# EAGLE schematic D1MSHO (EAGLE 9.0.1)
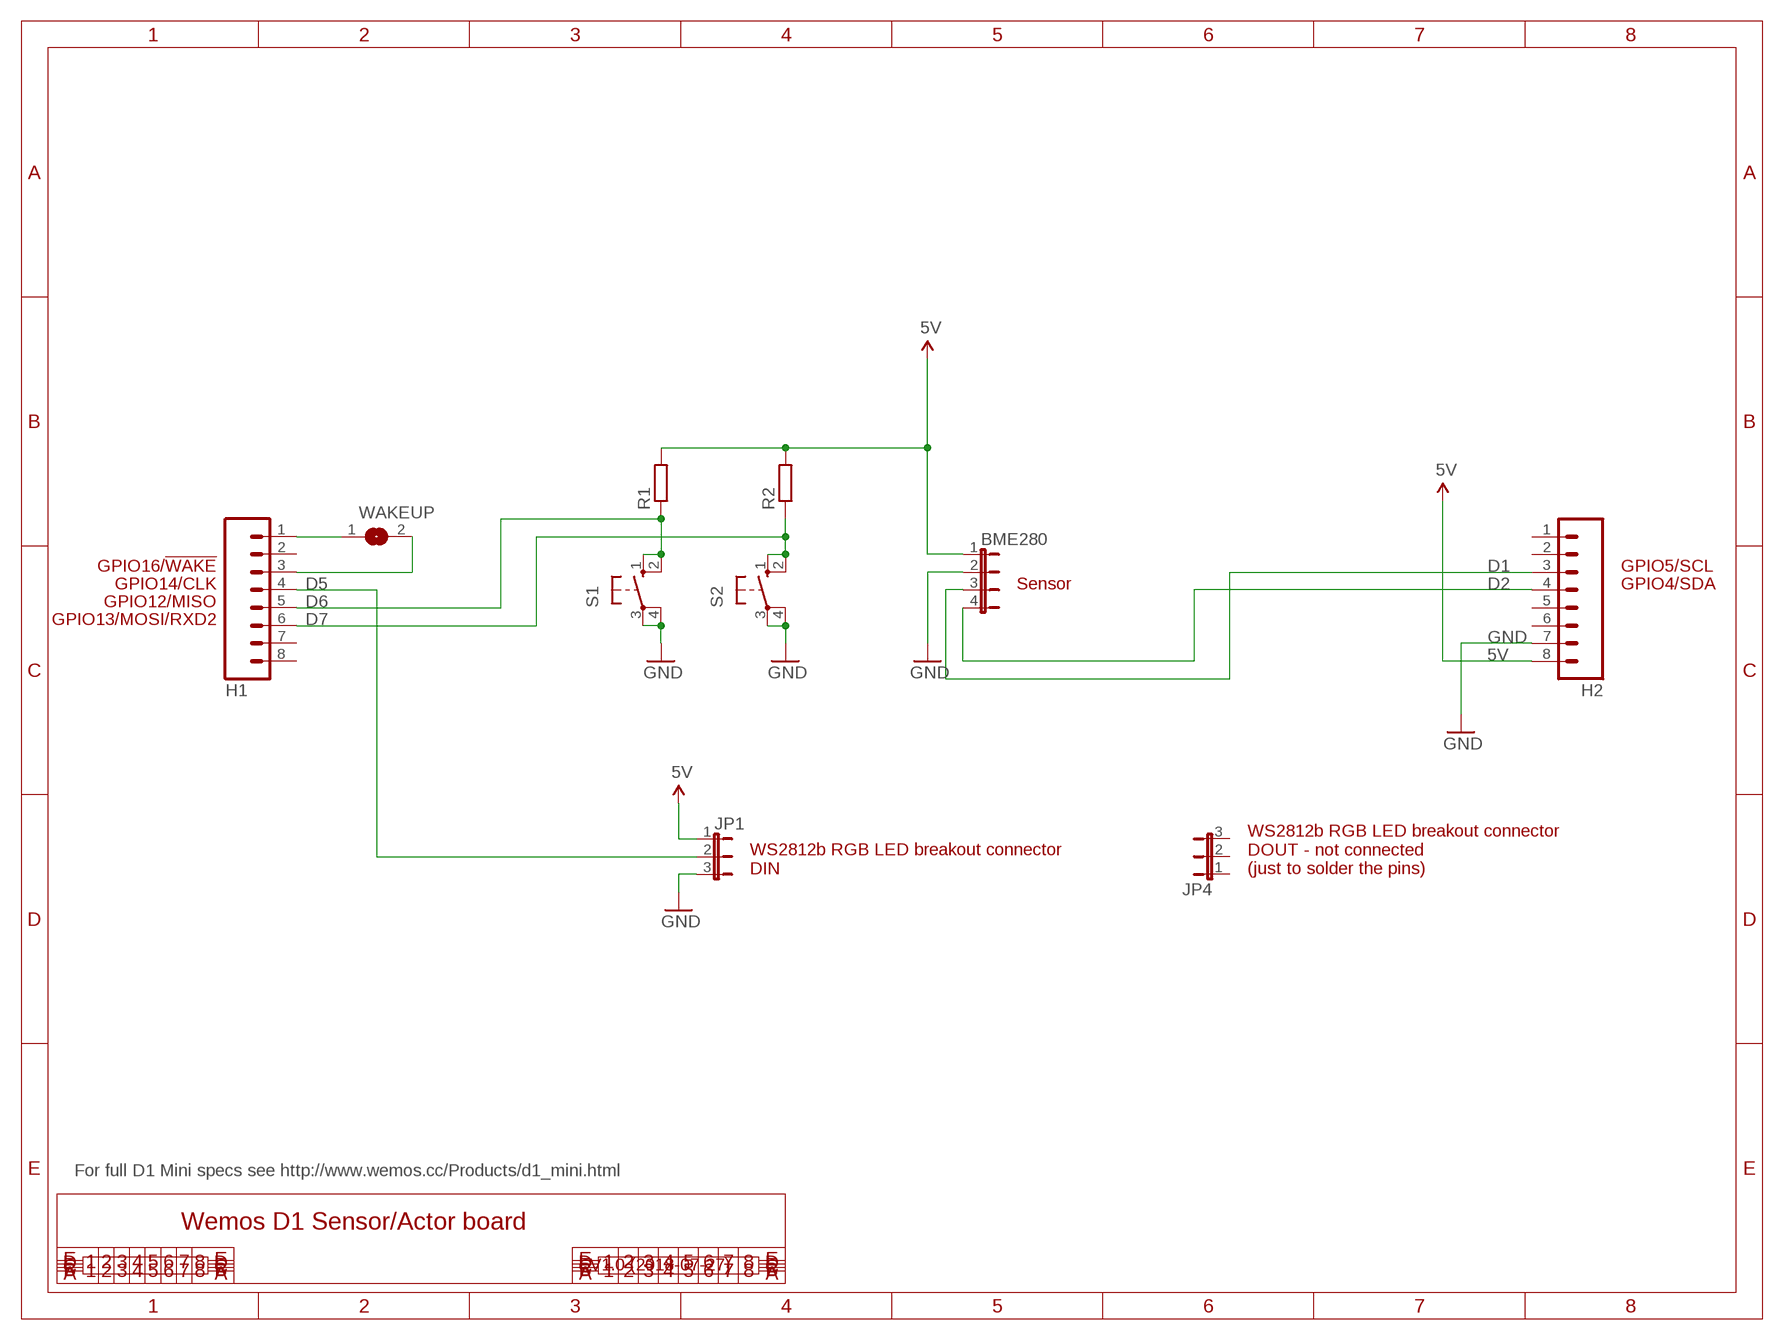
[diagram p0: schematic, sheet 1]

## Parts
BME280  JP4E  [JP4]
H1  M08  [1X08]
H2  M08  [1X08]
JP1  JP2E  [JP2]
JP4  JP2E  [JP2]
R1  R-EU_R0805  [R0805]
R2  R-EU_R0805  [R0805]
S1  10-XX  [B3F-10XX]
S2  10-XX  [B3F-10XX]
WAKEUP  SJ  [SJ]

## Nets
5V: BME280.1 H2.8 JP1.1 R1.2 R2.2
D1: BME280.3 H2.3
D2: BME280.4 H2.4
D5: H1.4 JP1.2
D6: H1.5 R1.1 S1.1(S) S1.2(S1)
D7: H1.6 R2.1 S2.1(S) S2.2(S1)
GND: BME280.2 H2.7 JP1.3 S1.3(P) S1.4(P1) S2.3(P) S2.4(P1)
N$1: H1.1 WAKEUP.1
N$2: H1.3 WAKEUP.2
Unconnected: H1.2 H1.7 H1.8 H2.1 H2.2 H2.5 H2.6 JP4.1 JP4.2 JP4.3

## Notes on the sheet
- GPIO16/!WAKE | GPIO5/SCL
- GPIO14/CLK | Sensor | GPIO4/SDA
- GPIO12/MISO
- GPIO13/MOSI/RXD2
- WS2812b RGB LED breakout connector
  DIN
- WS2812b RGB LED breakout connector
  DOUT - not connected
  (just to solder the pins)
- For full D1 Mini specs see http://www.wemos.cc/Products/d1_mini.html
- Wemos D1 Sensor/Actor board
- V1.0 (2018-07-27)

## Library data of the parts
BME280 = jumper:JP4E: JUMPER
H1 H2 = freetronics-original:M08: Header 8 Standard 8-pin 0.1" header. Use with straight break away headers (SKU : PRT-00116), right angle break away headers (PRT-00553), swiss pins (PRT-00743), machine pins (PRT-00117), and female headers (PRT-00115).
JP1 JP4 = jumper:JP2E: JUMPER
R1 R2 = rcl:R-EU_: RESISTOR, European symbol; SPICEPREFIX: R
S1 S2 = switch-omron:10-XX: OMRON SWITCH; MPN: B3F-1000; OC_FARNELL: 176432; OC_NEWARK: 36M3542
WAKEUP = jumper:SJ: SMD solder JUMPER

## Net classes
0 default: width 0.203 mm, drill 0.356 mm, clearance 0.152 mm
1 power: width 0.203 mm, clearance 0.152 mm